# Altium schematic sheet Power_SCH.SchDoc: Схема
size 420 x 297 mm; ApprovedBy: Мешков; CheckedBy: Черноскутов; Author: Самойлов; CompanyName: РГППУ; Title2str: питания; DecimalNumber: АБВГ.123456.001 33
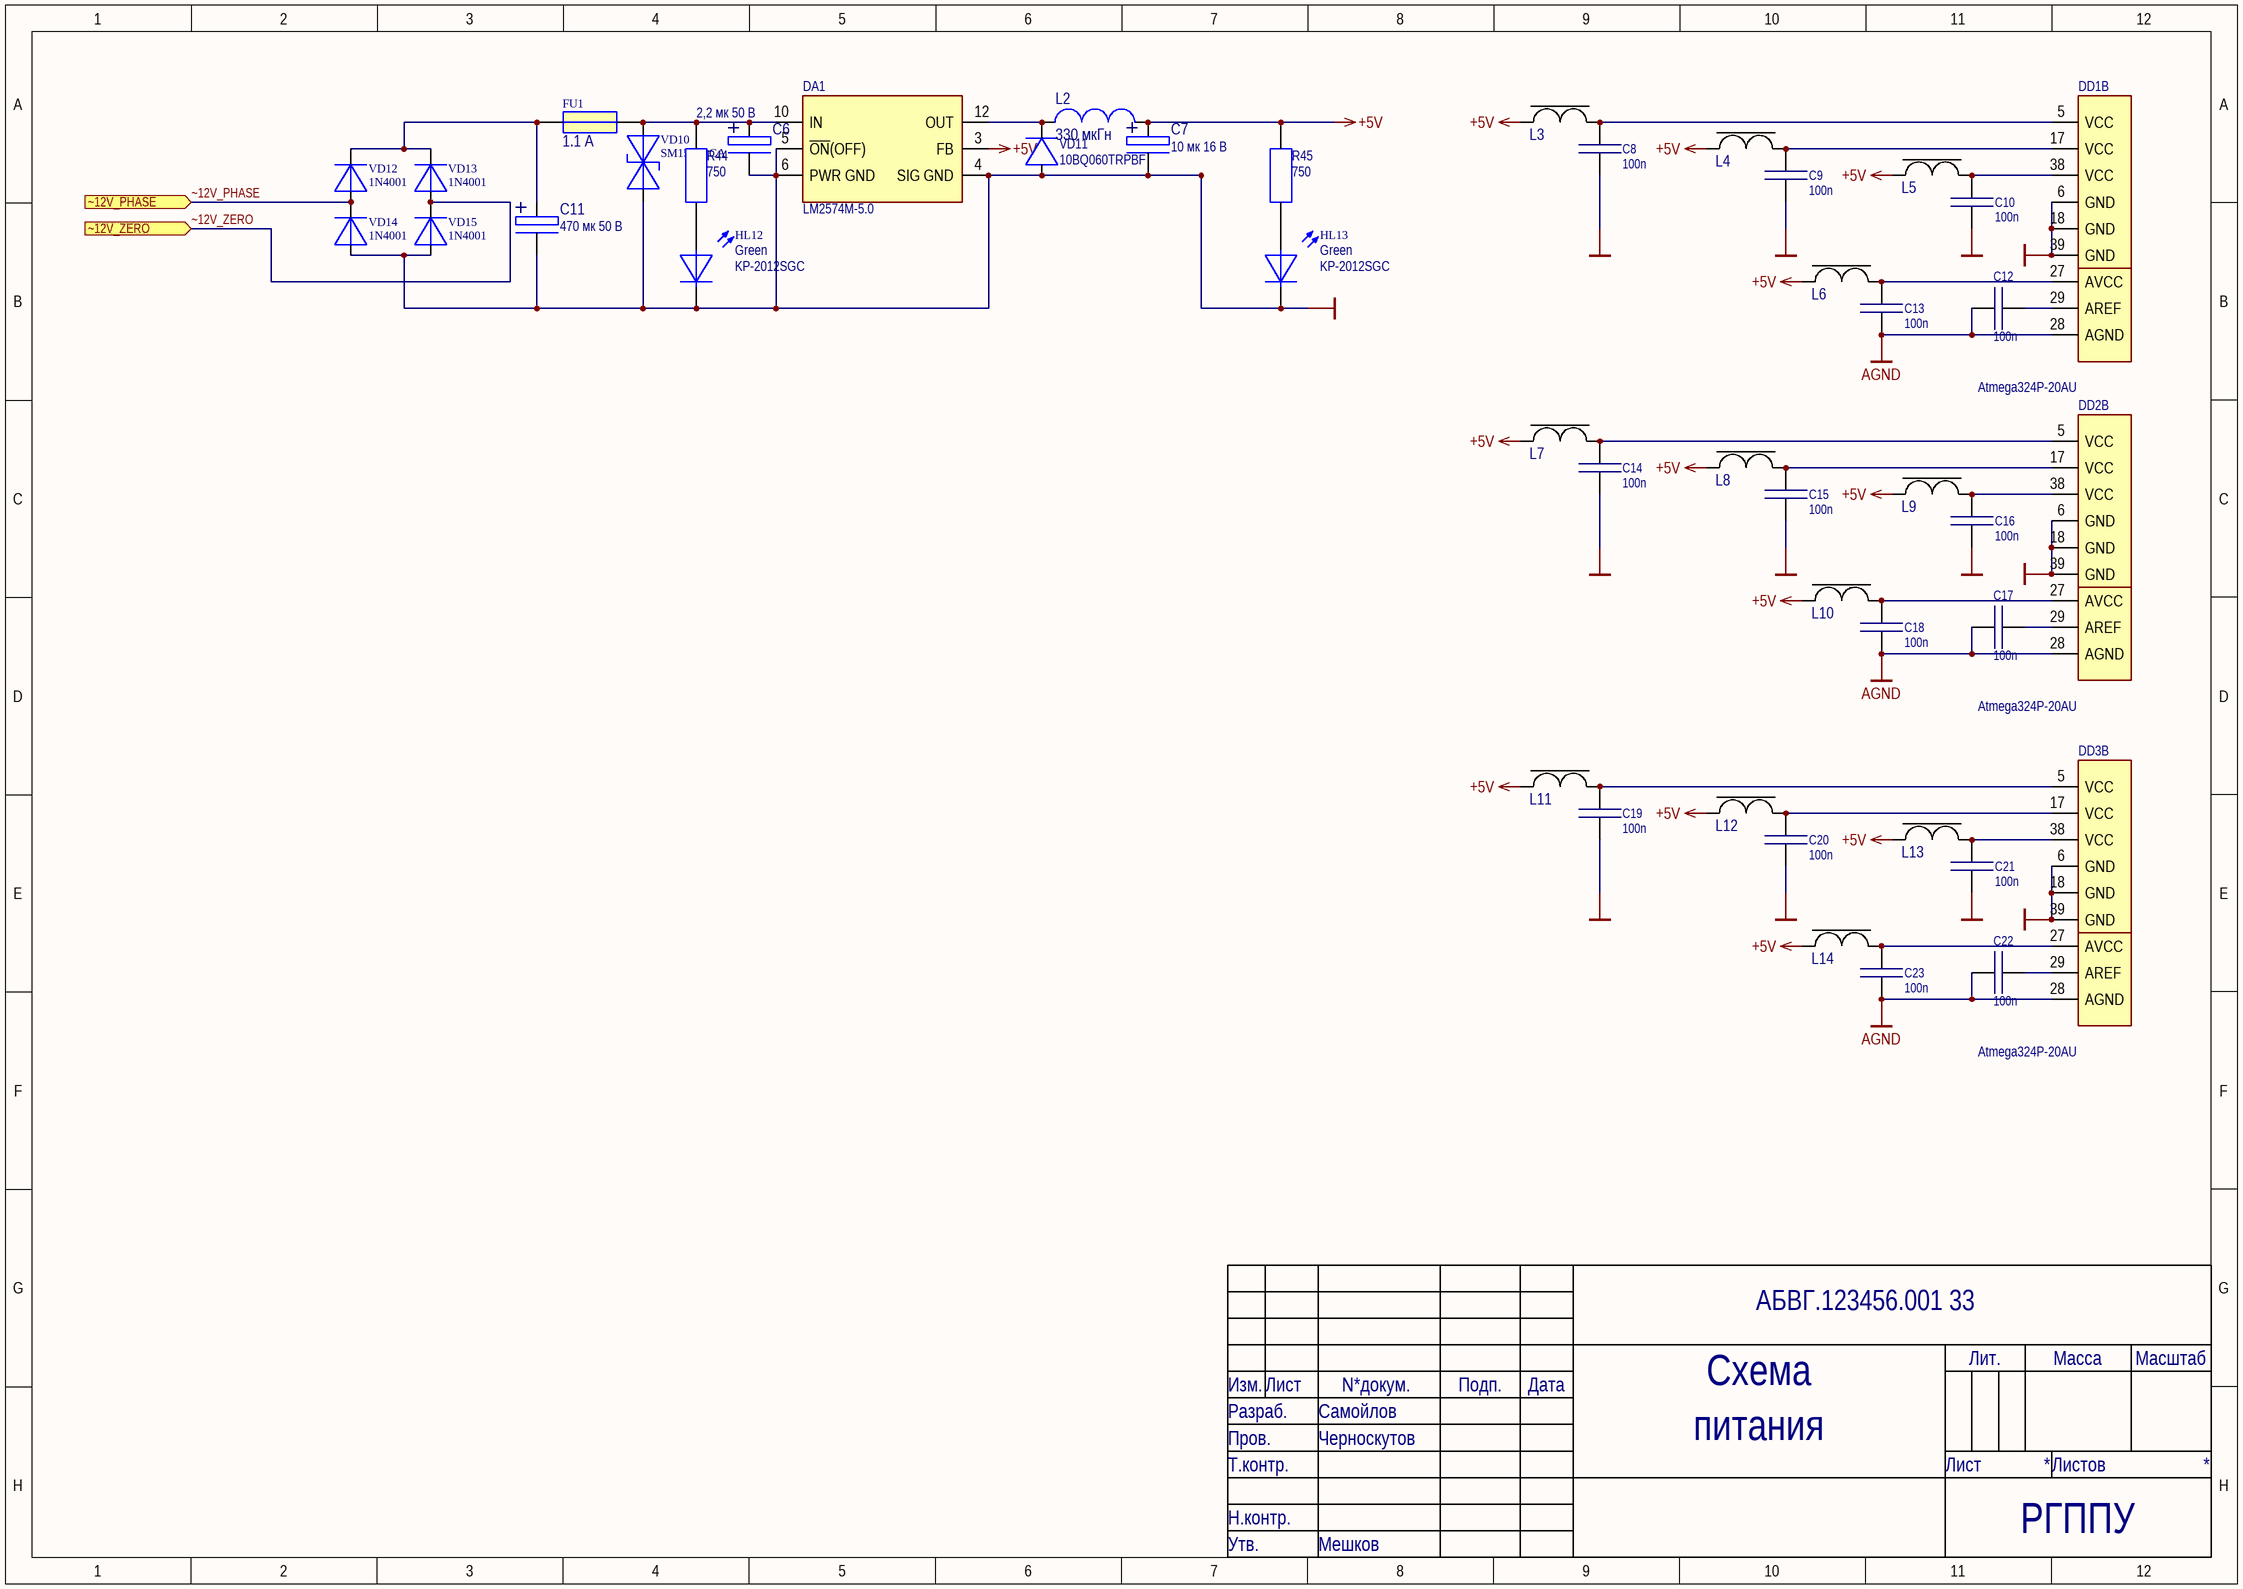
[diagram p0: Power_SCH.SchDoc]

## Parts
C6  value 2,2 мк 50 В  [CAP_POLAR_ELLYTE_B]  (hidden comment: CA050M2R20REB-0405)
C7  value 10 мк 16 В  [CAP_POLAR_ELLYTE_B]  (hidden comment: CA016M0010REB-0405)
C8  100n  [SMDRC0805]
C9  100n  [SMDRC0805]
C10  100n  [SMDRC0805]
C11  value 470 мк 50 В  [CAP_POLAR_10mm]  (hidden comment: CA035M0220REG)
C12  100n  [SMDRC0805]
C13  100n  [SMDRC0805]
C14  100n  [SMDRC0805]
C15  100n  [SMDRC0805]
C16  100n  [SMDRC0805]
C17  100n  [SMDRC0805]
C18  100n  [SMDRC0805]
C19  100n  [SMDRC0805]
C20  100n  [SMDRC0805]
C21  100n  [SMDRC0805]
C22  100n  [SMDRC0805]
C23  100n  [SMDRC0805]
DA1  LM2574M-5.0  [SOIC127P1030X264-14M]
DD1  Atmega324P-20AU  [44ML_M]  (part B of 2)
DD2  Atmega324P-20AU  [44ML_M]  (part B of 2)
DD3  Atmega324P-20AU  [44ML_M]  (part B of 2)
FU1  value 1.1 А  [EFuse 1.1A]  (hidden comment: EFuse LP60-110F)
HL12  Green  ManufacturerPartNumber: KP-2012SGC  [DIOMELF2012M]
HL13  Green  ManufacturerPartNumber: KP-2012SGC  [DIOMELF2012M]
L2  value 330 мкГн  [INDP7972X50M]  (hidden comment: SCD0705T-331K-N)
L3  MPZ1608S181A  [INDC0603X03M]  (value not drawn)
L4  MPZ1608S181A  [INDC0603X03M]  (value not drawn)
L5  MPZ1608S181A  [INDC0603X03M]  (value not drawn)
L6  MPZ1608S181A  [INDC0603X03M]  (value not drawn)
L7  MPZ1608S181A  [INDC0603X03M]  (value not drawn)
L8  MPZ1608S181A  [INDC0603X03M]  (value not drawn)
L9  MPZ1608S181A  [INDC0603X03M]  (value not drawn)
L10  MPZ1608S181A  [INDC0603X03M]  (value not drawn)
L11  MPZ1608S181A  [INDC0603X03M]  (value not drawn)
L12  MPZ1608S181A  [INDC0603X03M]  (value not drawn)
L13  MPZ1608S181A  [INDC0603X03M]  (value not drawn)
L14  MPZ1608S181A  [INDC0603X03M]  (value not drawn)
R44  750  [SMDRC0805]
R45  750  [SMDRC0805]
VD10  SM15T12CA  [SUPRES3216X18N]
VD11  10BQ060TRPBF  [SHOTKY 4.1x3.3]
VD12  1N4001  [PinDiode]
VD13  1N4001  [PinDiode]
VD14  1N4001  [PinDiode]
VD15  1N4001  [PinDiode]

## Ports
~12V_PHASE (in), ~12V_ZERO (in)

## Nets
+5V: C7.2(+) DA1.3(FB) L2.1 L3.1 L4.1 L5.1 L6.1 L7.1 L8.1 L9.1 L10.1 L11.1 L12.1 L13.1 L14.1 R45.2
AGND: C12.1 C13.1 C17.1 C18.1 C22.1 C23.1 DD1.28(AGND) DD2.28(AGND) DD3.28(AGND)
GND: C6.1(-) C7.1(-) C8.1 C9.1 C10.1 C11.1(-) C14.1 C15.1 C16.1 C19.1 C20.1 C21.1 DA1.4(SIG_GND) DA1.5(~{ON}(OFF)) DA1.6(PWR_GND) DD1.6(GND) DD1.18(GND) DD1.39(GND) DD2.6(GND) DD2.18(GND) DD2.39(GND) DD3.6(GND) DD3.18(GND) DD3.39(GND) HL12.2 HL13.2 VD10.1 VD11.A VD14.A VD15.A
~12V_PHASE: VD12.A VD14.K ; port ~12V_PHASE
~12V_ZERO: VD13.A VD15.K ; port ~12V_ZERO
NetC6_2: C6.2(+) DA1.10(IN) FU1.2 R44.2 VD10.2
NetC8_2: C8.2 DD1.5(VCC) L3.2
NetC9_2: C9.2 DD1.17(VCC) L4.2
NetC10_2: C10.2 DD1.38(VCC) L5.2
NetC11_2: C11.2(+) FU1.1 VD12.K VD13.K
NetC12_2: C12.2 DD1.29(AREF)
NetC13_2: C13.2 DD1.27(AVCC) L6.2
NetC14_2: C14.2 DD2.5(VCC) L7.2
NetC15_2: C15.2 DD2.17(VCC) L8.2
NetC16_2: C16.2 DD2.38(VCC) L9.2
NetC17_2: C17.2 DD2.29(AREF)
NetC18_2: C18.2 DD2.27(AVCC) L10.2
NetC19_2: C19.2 DD3.5(VCC) L11.2
NetC20_2: C20.2 DD3.17(VCC) L12.2
NetC21_2: C21.2 DD3.38(VCC) L13.2
NetC22_2: C22.2 DD3.29(AREF)
NetC23_2: C23.2 DD3.27(AVCC) L14.2
NetDA1_12: DA1.12(OUT) L2.2 VD11.K
NetHL12_1: HL12.1 R44.1
NetHL13_1: HL13.1 R45.1

## Notes on the sheet
- Изм.
- Лист
- N*докум.
- Подп.
- Дата
- Лит.
- Масса
- Масштаб
- Разраб.
- Пров.
- Т.контр.
- Лиcт
- Лиcтов
- Н.контр.
- Утв.

## Library data of the parts
C6 = 02200_050: 2,2uF 50V Polar capacitor; Manufacturer: Yageo; ManufacturerPartNumber: CA050M2R20REB-0405; Supplier: Промэлектроника; Cost: 4,11; Package: not standard; ComponentLink1Description: Datasheet; ComponentLink1URL: http://www.yageo.com/documents/recent/E-Cap_SurfaceMount_CA_2011.pdf; ComponentLink2Description: Datasheet-local; ComponentLink2URL: *
C7 = 10000_016: 10uF 16V Polar SMD cap; Manufacturer: YAGEO; ManufacturerPartNumber: CA016M0010REB-0405; Supplier: -; Cost: 3,03; Package: штырьевой; ComponentLink1Description: Datasheet; ComponentLink2Description: Datasheet-local
C8-C10 C12-C23 = Capacitor 0805 100n: Generic capasitor non-polar; PartNumber: Capacitor 0805 100n; Value: 100n; ComponentLink1Description: Datasheet; Package: 0805
C11 = 470000_050: 470uF 50V Polar capacitor; Manufacturer: Yageo; ManufacturerPartNumber: CA035M0220REG; Supplier: Промэлектроника; Cost: 20,14; Package: not standard; ComponentLink1Description: Datasheet; ComponentLink1URL: http://www.promelec.ru/pdf/CA_2011.pdf; ComponentLink2Description: Datasheet-local; ComponentLink2URL: *
DD1-DD3 = Atmega324P-20AU: Microcontroller 8-bit; Manufacturer: Atmel; ComponentLink1URL: http://www.atmel.com/Images/Atmel-8011-8-bit-AVR-Microcontroller-ATmega164P-324P-644P_datasheet.pdf; ComponentLink1Description: Datasheet; Cost: 220; Package: TQFP-44; Supplier: Промэлектроника; ManufacturerPartNumber: Atmega324P-20AU
FU1 = EFuse LP60-110F: Fuse; ManufacturerPartNumber: EFuse LP60-110F; ComponentLink1Description: Datasheet; ComponentLink2Description: Datasheet-local; ComponentLink2URL: *
HL12 HL13 = LED1_G: Diod LED SMD Green; ComponentLink1Description: Datasheet; Cost: 2,88; ComponentLink2Description: Datasheet-local; ComponentLink2URL: *; Color: Green
L2 = SCD0705T-331K-N: Inductor; ManufacturerPartNumber: SCD0705T-331K-N; ComponentLink1Description: Datasheet; ComponentLink1URL: http://download.siliconexpert.com/pdfs/2010/12/8/6/47/4/732/yageo_/manual/inductors_smdpower_scd_2010.pdf; ComponentLink2Description: Datasheet-local; ComponentLink2URL: *
L3-L14 = Ferrite Bead: Value: ? мГн; ManufacturerPartNumber: MPZ1608S181A; ComponentLink1Description: Datasheet; Supplier: Промэлектроника; ComponentLink2Description: Datasheet-local; ComponentLink2URL: *
R44 R45 = Resistor 0805 750: Generic resistor; PartNumber: Resistor 0805 750; Value: 750; ComponentLink1URL: http://www.mouser.com/ds/2/447/PYu-RC0402_51_RoHS_L_6_r-8721.pdf; ComponentLink1Description: Datasheet; Package: 0805
VD10 = SM15T12CA: Diod suppressor; Manufacturer: ST Microelectronics; Notes: 12 В; ComponentLink1Description: Datasheet; ComponentLink1URL: http://www.st.com/st-web-ui/static/active/en/resource/technical/document/datasheet/CD00000724.pdf; Cost: 16,73; Package: SMC/DO-214AB; Supplier: Промэлектроника; ComponentLink2Description: Datasheet-local; ComponentLink2URL: *; ManufacturerPartNumber: SM15T12CA
VD11 = 10BQ060TRPBF: DIODE SCHOTTKY 60V 1A DO214AA; Manufacturer: Vishay Semiconductor Diodes Division; Voltage - Forward (Vf) (Max) @ If: 600mV @ 1A; Current - Reverse Leakage @ Vr: 100µA @ 60V; Category: Discrete Semiconductor Products; Diode Type: Schottky; Voltage - DC Reverse (Vr) (Max): 60V; Current - Average Rectified (Io): 1A; Reverse Recovery Time (trr): -; Mounting Type: Surface Mount; Package / Case: DO-214AA, SMB; Operating Temperature - Junction: -55°C ~ 150°C; ComponentLink1URL: http://www.vishay.com/docs/94113/vs-10bq060pbf.pdf; ComponentLink1Description: http://www.vishay.com/docs/94113/vs-10bq060pbf.pdf; ManufacturerPartNumber: 10BQ060TRPBF
VD12-VD15 = 1N4001: Rectifying diode; ComponentLink1Description: Datasheet; ComponentLink1URL: http://www.promelec.ru/pdf/1N400x.pdf; Cost: 5; Package: штырьевой; ComponentLink2Description: Datasheet-local; ComponentLink2URL: *; ManufacturerPartNumber: 1N4001
DA1 = LM2574M-5.0: ManufacturerPartNumber: LM2574M-5.0